# Altium schematic sheet p01_title_page.SchDoc
size 386 x 241 mm
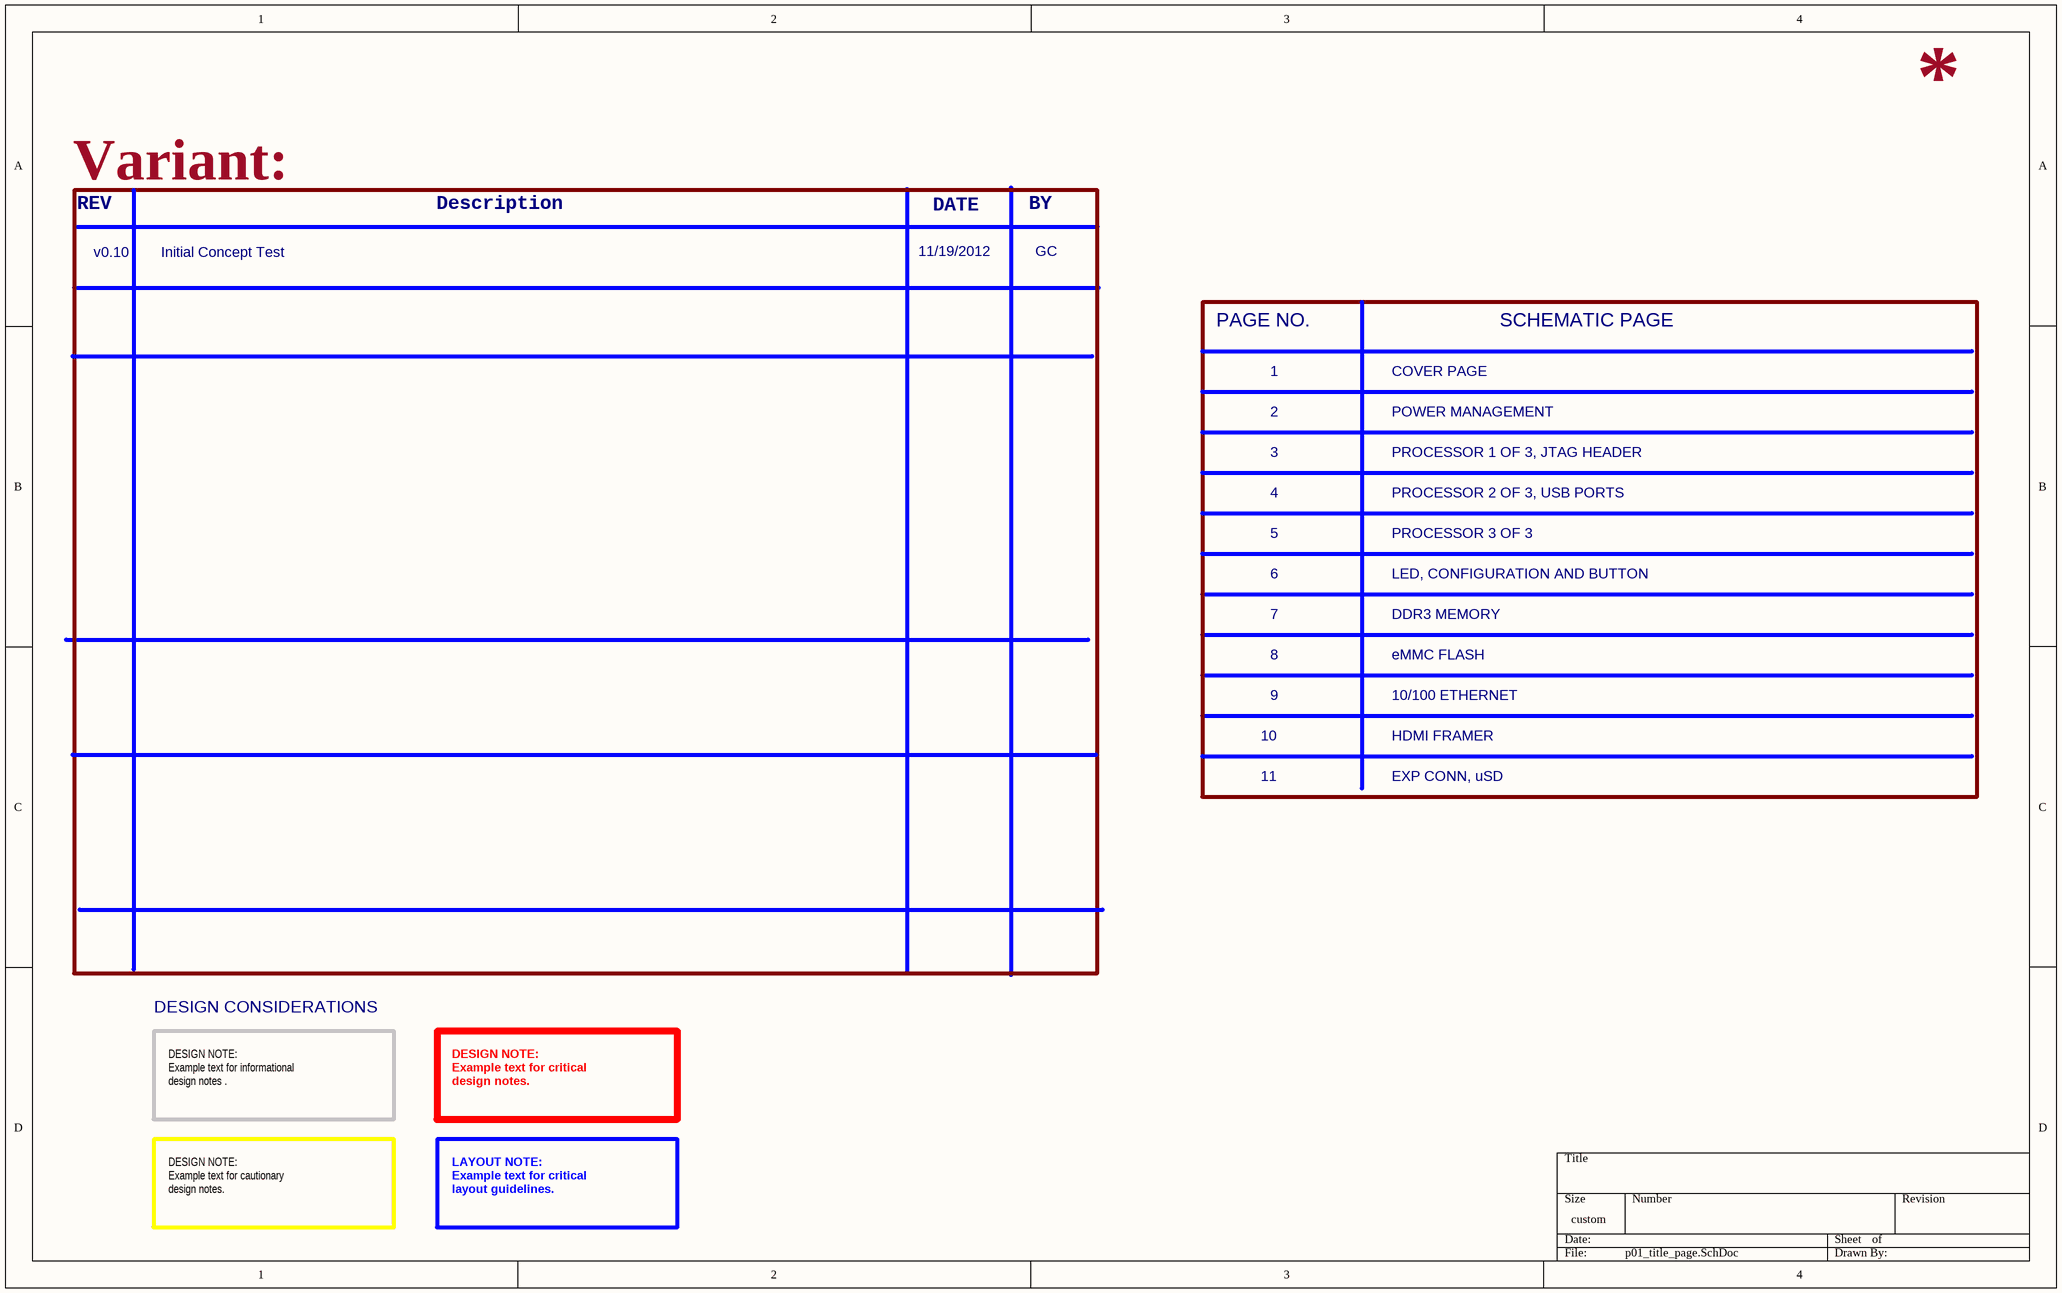
[diagram p0: p01_title_page.SchDoc]

## Notes on the sheet
- Variant:
- REV
- Description
- DATE
- BY
- v0.10
- Initial Concept Test
- 11/19/2012
- GC
- PAGE NO.
- SCHEMATIC PAGE
- 1
- 2
- POWER MANAGEMENT
- COVER PAGE
- 3
- 4
- PROCESSOR 2 OF 3, USB PORTS
- PROCESSOR 1 OF 3, JTAG HEADER
- 5
- PROCESSOR 3 OF 3
- 7
- 6
- DDR3 MEMORY
- LED, CONFIGURATION AND BUTTON
- 8
- 9
- eMMC FLASH
- 10/100 ETHERNET
- 10
- HDMI FRAMER
- 11
- EXP CONN, uSD
- DESIGN CONSIDERATIONS
- DESIGN NOTE:
  Example text for informational
  design notes .
- DESIGN NOTE:
  Example text for critical
  design notes.
- DESIGN NOTE:
  Example text for cautionary
  design notes.
- LAYOUT NOTE:
  Example text for critical
  layout guidelines.